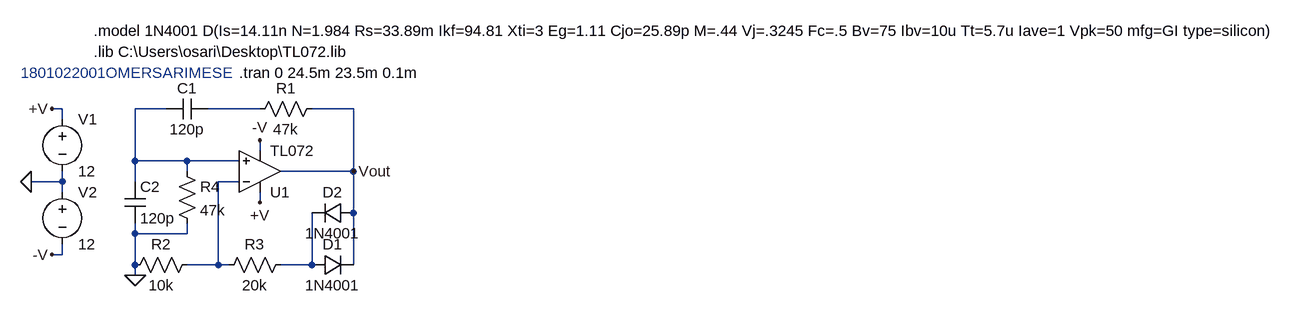
[diagram p0: schematic Draft2.asc]
Draft2.asc, the LTspice schematic file:
Version 4
SHEET 1 2072 680
WIRE -16 48 -32 48
WIRE 144 48 96 48
WIRE 288 48 208 48
WIRE 432 48 368 48
WIRE -16 64 -16 48
WIRE 288 112 288 96
WIRE 96 128 96 48
WIRE 176 128 96 128
WIRE 256 128 176 128
WIRE 176 144 176 128
WIRE 432 144 432 48
WIRE 432 144 320 144
WIRE -16 160 -16 144
WIRE -16 160 -64 160
WIRE 96 160 96 128
WIRE 256 160 224 160
WIRE -16 176 -16 160
WIRE 288 192 288 176
WIRE 432 208 432 144
WIRE 96 240 96 224
WIRE 176 240 176 224
WIRE 176 240 96 240
WIRE -16 272 -16 256
WIRE -16 272 -32 272
WIRE 96 288 96 240
WIRE 224 288 224 160
WIRE 224 288 176 288
WIRE 240 288 224 288
WIRE 368 288 368 208
WIRE 368 288 320 288
WIRE 432 288 432 208
WIRE 96 304 96 288
FLAG -64 160 0
FLAG -32 48 +V
FLAG -32 272 -V
FLAG 288 192 +V
FLAG 288 96 -V
FLAG 96 304 0
FLAG 432 144 Vout
SYMBOL voltage -16 48 R0
WINDOW 123 0 0 Left 0
WINDOW 39 0 0 Left 0
SYMATTR InstName V1
SYMATTR Value 12
SYMBOL voltage -16 160 R0
WINDOW 123 0 0 Left 0
WINDOW 39 0 0 Left 0
SYMATTR InstName V2
SYMATTR Value 12
SYMBOL cap 208 32 R90
WINDOW 0 0 32 VBottom 2
WINDOW 3 32 32 VTop 2
SYMATTR InstName C1
SYMATTR Value 120p
SYMBOL res 384 32 R90
WINDOW 0 0 56 VBottom 2
WINDOW 3 32 56 VTop 2
SYMATTR InstName R1
SYMATTR Value 47k
SYMBOL OpAmps\\opamp2 288 208 M180
SYMATTR InstName U1
SYMATTR Value TL072
SYMBOL cap 80 160 R0
SYMATTR InstName C2
SYMATTR Value 120p
SYMBOL res 192 272 R90
WINDOW 0 0 56 VBottom 2
WINDOW 3 32 56 VTop 2
SYMATTR InstName R2
SYMATTR Value 10k
SYMBOL res 336 272 R90
WINDOW 0 0 56 VBottom 2
WINDOW 3 32 56 VTop 2
SYMATTR InstName R3
SYMATTR Value 20k
SYMBOL res 160 128 R0
SYMATTR InstName R4
SYMATTR Value 47k
SYMBOL diode 368 304 R270
WINDOW 0 32 32 VTop 2
WINDOW 3 0 32 VBottom 2
SYMATTR InstName D1
SYMATTR Value 1N4001
SYMBOL diode 432 192 R90
WINDOW 0 0 32 VBottom 2
WINDOW 3 32 32 VTop 2
SYMATTR InstName D2
SYMATTR Value 1N4001
TEXT 32 -40 Left 2 !.lib C:\\Users\\osari\\Desktop\\TL072.lib
TEXT 32 -72 Left 2 !.model 1N4001 D(Is=14.11n N=1.984 Rs=33.89m Ikf=94.81 Xti=3 Eg=1.11 Cjo=25.89p M=.44 Vj=.3245 Fc=.5 Bv=75 Ibv=10u Tt=5.7u Iave=1 Vpk=50 mfg=GI type=silicon)
TEXT 256 -8 Left 2 !.tran 0 24.5m 23.5m 0.1m
TEXT -80 -8 Left 2 ;1801022001OMERSARIMESE

The netlist it stands for:
* Draft2.asc
V1 +V 0 12
V2 0 -V 12
C1 N002 N001 120p
R1 Vout N002 47k
XU1 N001 N003 +V -V Vout TL072  ; pins In+ In- V+ V- OUT
C2 N001 0 120p
R2 N003 0 10k
R3 N004 N003 20k
R4 N001 0 47k
D1 N004 Vout 1N4001
D2 Vout N004 1N4001
.model D D
.lib standard.dio
.lib C:\Users\osari\Desktop\TL072.lib
.model 1N4001 D(Is=14.11n N=1.984 Rs=33.89m Ikf=94.81 Xti=3 Eg=1.11 Cjo=25.89p M=.44 Vj=.3245 Fc=.5 Bv=75 Ibv=10u Tt=5.7u Iave=1 Vpk=50 mfg=GI type=silicon)
.tran 0 24.5m 23.5m 0.1m
* 1801022001OMERSARIMESE
.backanno
.end